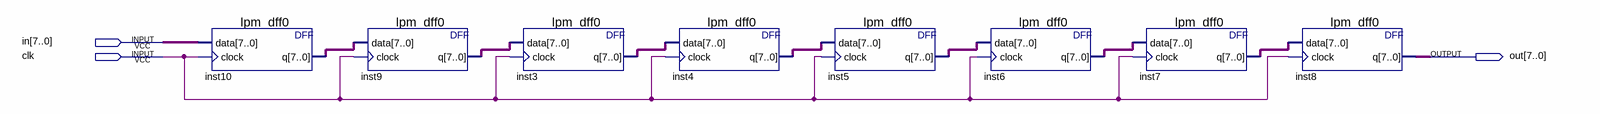
[diagram p0: schematic sheet]
// Quartus schematic buf.bdf as structural Verilog: 8 symbols, 3 pins
module \buf  (
  input  [7:0] in,
  input  clk,
  output [7:0] out
);

  wire [7:0] inst3_q, inst4_q, inst5_q, inst6_q, inst7_q, inst9_q, inst10_q;

  lpm_dff0 inst10 (.data(in), .clock(clk), .q(inst10_q));
  lpm_dff0 inst9 (.data(inst10_q), .clock(clk), .q(inst9_q));
  lpm_dff0 inst3 (.data(inst9_q), .clock(clk), .q(inst3_q));
  lpm_dff0 inst4 (.data(inst3_q), .clock(clk), .q(inst4_q));
  lpm_dff0 inst5 (.data(inst4_q), .clock(clk), .q(inst5_q));
  lpm_dff0 inst6 (.data(inst5_q), .clock(clk), .q(inst6_q));
  lpm_dff0 inst7 (.data(inst6_q), .clock(clk), .q(inst7_q));
  lpm_dff0 inst8 (.data(inst7_q), .clock(clk), .q(out));
endmodule
